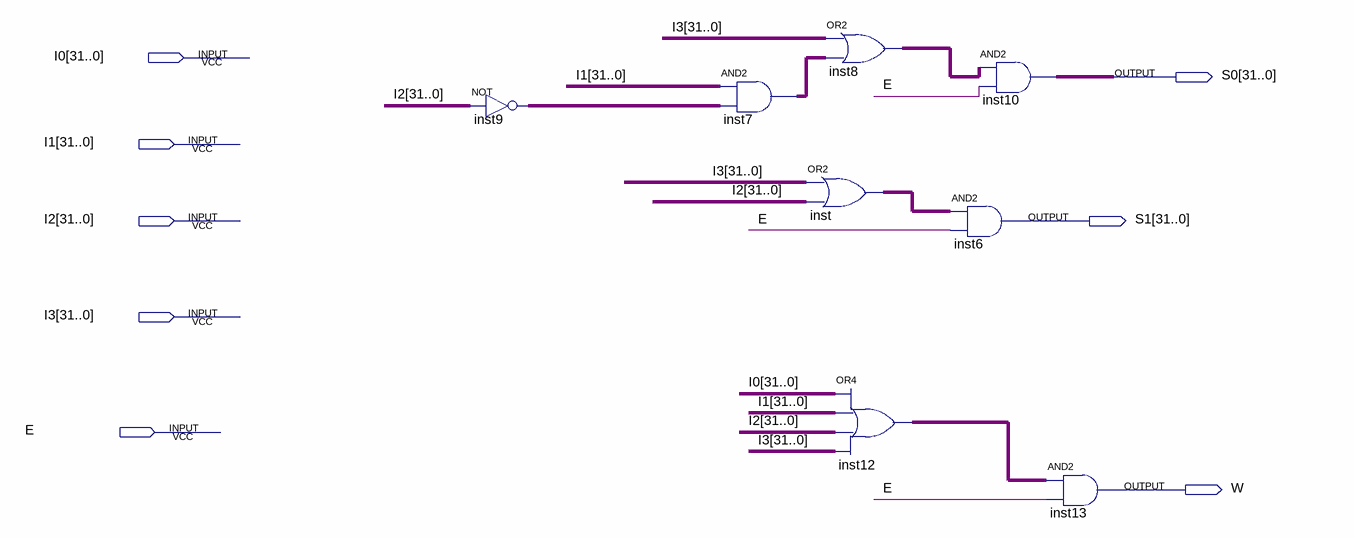
[diagram p0: schematic sheet]
// Quartus schematic pCD4_32.bdf as structural Verilog: 8 symbols, 8 pins
module pCD4_32 (
  input  [31:0] I0,
  input  [31:0] I1,
  input  [31:0] I2,
  input  [31:0] I3,
  input  E,
  output [31:0] S0,
  output [31:0] S1,
  output W
);

  wire [31:0] inst7_out, inst8_out, inst9_out, inst12_out, inst_out;

  assign inst9_out = ~I2;  // NOT inst9, 32 bits wide
  assign inst7_out = I1 & inst9_out;  // AND2 inst7, 32 bits wide
  assign inst8_out = I3 | inst7_out;  // OR2 inst8, 32 bits wide
  assign inst_out = I3 | I2;  // OR2 inst, 32 bits wide
  assign inst12_out = I0 | I1 | I2 | I3;  // OR4 inst12, 32 bits wide
  assign S0 = inst8_out & {32{E}};  // AND2 inst10, 32 bits wide
  assign S1 = inst_out & {32{E}};  // AND2 inst6, 32 bits wide
  assign W = inst12_out & {32{E}};  // AND2 inst13, 32 bits wide
endmodule
